# EasyEDA Pro project STM Embedded BD.eprj, schematic ATmega Embedded BD
Create Date: 2024-04-15; Page Name: 1 / 1; Project Name: STM Embedded BD; Schematic Name: ATmega Embedded BD; Update Date: 2024-04-16; Company: EasyEDA.com; Drawn: EasyEDA; Page Size: A4; Part Number: JLCPCB-002; Reviewed: EasyEDA; Version: V0.1
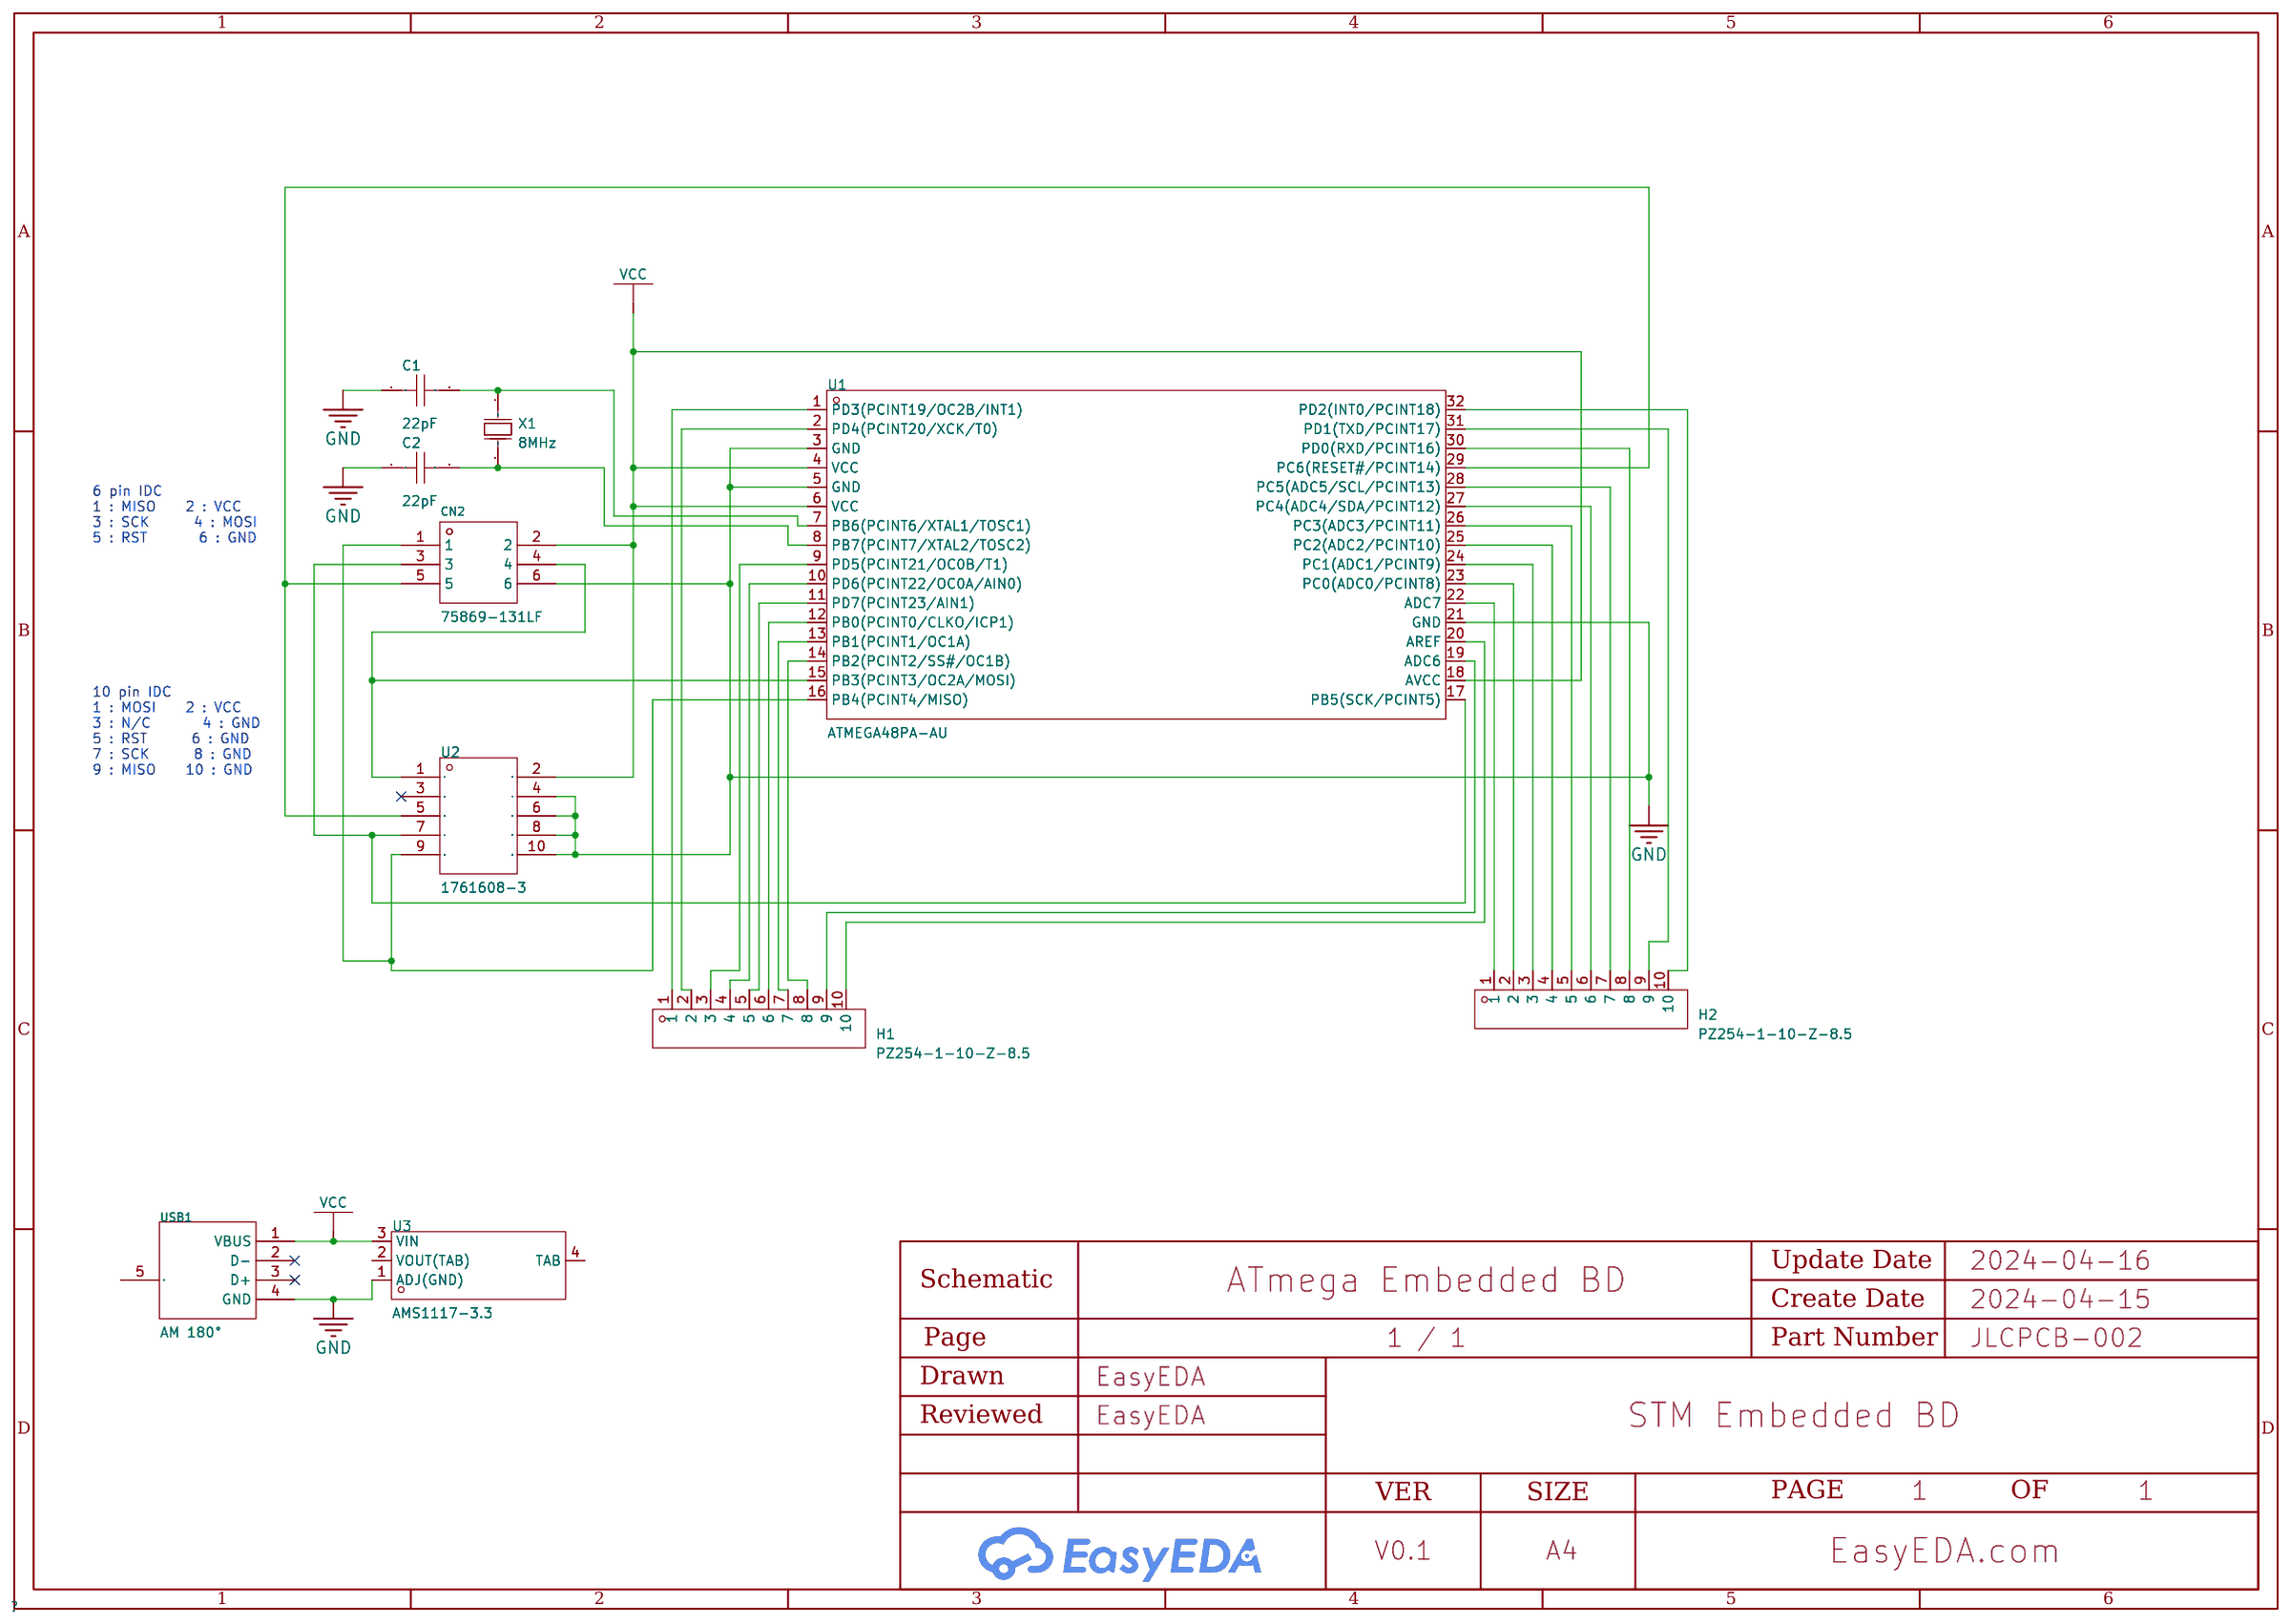
[diagram p1: schematic sheet]

## Parts
C1  22pF  [C0603]
C2  22pF  [C0603]
CN2  75869-131LF  [CONN-TH_6P-P2.54_75869-131LF]
H1  PZ254-1-10-Z-8.5  [HDR-TH_10P-P2.54-V-M]
H2  PZ254-1-10-Z-8.5  [HDR-TH_10P-P2.54-V-M]
U1  ATMEGA48PA-AU  [TQFP-32_L7.0-W7.0-P0.80-LS9.0-BL]
U2  1761608-3  [IDC-TH_10P-P2.54-S2.54_L9.2-W20.3]
U3  AMS1117-3.3  [SOT-223-4_L6.5-W3.5-P2.30-LS7.0-BR]
USB1  AM 180°  [USB-SMD_AM180]
X1  8MHz  [CRYSTAL-SMD_L11.5-W4.8-LS12.7]

## Library data of the parts
C1 C2 = 0603CG220J500NT: Capacitance: Tolerance:±5% Tolerance:±5% Voltage Rated: Temperature Coefficient:; LCSC Part Name: 22pF ±5% 50V; Supplier Part: C91701; Manufacturer: FH(风华); Supplier Footprint: 0603; JLCPCB Part Class: Extended Part; Datasheet: https://atta.szlcsc.com/upload/public/pdf/source/20200305/C486355_26A10D38EF8C2A5C37091D0039909270.pdf; Supplier: LCSC; Tolerance: ±5%
CN2 = 75869-131LF: Pins Structure:2x3P Pitch:2.54mm Mounting Style:Straight Reference Series:- Number of Pins:6P Number of Rows:2 Number of PINs Per Row:3 Row Spacing:2.54mm Contact Material:Phosphor bronze Contact Plating:Tin; LCSC Part Name: 间距:2.54mm 2x3P 直插 蓝色; Supplier Part: C168680; Manufacturer: Amphenol; Supplier Footprint: 插件,P=2.54mm; JLCPCB Part Class: Extended Part; Datasheet: https://atta.szlcsc.com/upload/public/pdf/source/20180316/C63A43DF70B4EBFBD28CCA94FAEE0128.pdf; Supplier: LCSC; Pins Structure: 2x3P; Pitch: 2.54mm; Mounting Style: Straight; Number of Pins: 6P; Number of Rows: 2; Number of PINs Per Row: 3; Row Spacing: 2.54mm; Contact Material: Phosphor bronze; Contact Plating: Tin
H1 H2 = PZ254-1-10-Z-8.5: Pin Structure:1x10P Pitch:2.54mm Row Spacing:- Circluar Pins/Square Pins:Square Pins Mounting Type:Straight Number of Rows:Plugin Number of Pins:10P Current Rating (Max):3A Voltage Rating (Max):- Length of Mating Pin:6mm Insulation Height:2.5mm Length of; LCSC Part Name: 1x10P 间距:2.54mm 方针 直插; Supplier Part: C2894933; Manufacturer: HCTL(华灿天禄); Supplier Footprint: 插件,P=2.54mm; JLCPCB Part Class: Extended Part; Datasheet: https://atta.szlcsc.com/upload/public/pdf/source/20240305/0F0A2A5C422E5D195558C9C26715A031.pdf; Supplier: LCSC; Pin Structure: 1x10P; Pitch: 2.54mm; Circluar Pins/Square Pins: Square Pins; Mounting Type: Straight; Number of Rows: Plugin; Number of Pins: 10P; Current Rating (Max): 3A; Length of Mating Pin: 6mm; Insulation Height: 2.5mm; Length of End Connection Pin: 3mm; Operating Temperature Range: -40℃~+105℃; Soldering Temperature(Max): 260℃@10S; Color: Black
U1 = ATMEGA48PA-AU: CPU Core:AVR Program Storage Size:4KB GPIO Ports Number:23 Operating Voltage Range:1.8V~5.5V Operating Voltage Range:1.8V~5.5V CPU Maximum Speed:20MHz Operating Temperature Range:-40℃~+85℃ Operating Temperature Range:-40℃~+85℃ ADC (Bit):10bit Watchdog:有 L; LCSC Part Name: 基于AVR增强型RISC架构的低功耗CMOS 8位微控制器; Supplier Part: C9433; Manufacturer: MICROCHIP(美国微芯); Supplier Footprint: TQFP-32(7x7); JLCPCB Part Class: Extended Part; Datasheet: https://atta.szlcsc.com/upload/public/pdf/source/20140724/1457707175179.pdf; Supplier: LCSC; CPU Core: AVR; Program Storage Size: 4KB; GPIO Ports Number: 23; Operating Voltage Range: 1.8V~5.5V; CPU Maximum Speed: 20MHz; Operating Temperature Range: -40℃~+85℃; ADC (Bit): 10bit; Watchdog: 有; Low-Voltage Detect: 有; Internal Oscillator: 有
U2 = 1761608-3: Pins Structure:2x5P Pitch:2.54mm Mounting Style:Straight Reference Series:- Number of Pins:10P Number of Rows:2 Number of PINs Per Row:5 Row Spacing:2.54mm Current Rating (Max):1A Contact Material:Phosphor bronze Contact Plating:Tin Operating Temperature; Supplier Part: C305912; Manufacturer: TE Connectivity(泰科电子); Supplier Footprint: 插件,P=2.5mm; JLCPCB Part Class: Extended Part; Datasheet: https://atta.szlcsc.com/upload/public/pdf/source/20181023/C305913_13B9A14E6BC94F99D9146D7418167983.pdf; Supplier: LCSC; Pins Structure: 2x5P; Pitch: 2.54mm; Mounting Style: Straight; Number of Pins: 10P; Number of Rows: 2; Number of PINs Per Row: 5; Row Spacing: 2.54mm; Current Rating (Max): 1A; Contact Material: Phosphor bronze; Contact Plating: Tin; Operating Temperature Range: -65℃~+105℃
U3 = AMS1117-3.3_C347222: Output Type: Maximum Input Voltage:12V Output Voltage:3.3V Output Voltage:3.3V MAX Output Current:1A Power Supply Rejection Ratio (PSRR):60dB@(120Hz) Dropout Voltage:1.3V@(1A) standby current:- Noise:- Feature:- Operating Temperature:- Operating Temperatu; LCSC Part Name: 输出:3.3V 电流:1A 耐压:12V; Supplier Part: C347222; Manufacturer: UMW(友台半导体); Supplier Footprint: SOT-223; JLCPCB Part Class: Extended Part; Datasheet: https://atta.szlcsc.com/upload/public/pdf/source/20231109/155D79A26D9DB04352555A58D5969DC8.pdf; Supplier: LCSC; Maximum Input Voltage: 12V; Output Voltage: 3.3V; MAX Output Current: 1A; Power Supply Rejection Ratio (PSRR): 60dB@(120Hz); Dropout Voltage: 1.3V@(1A); Output Polarity: Positive electrode; Number of Outputs: 1
USB1 = AM 180°: Connector Type:Type-A Standard:USB 2.0 Gender:公 Number of Ports:1 Number of Contacts:4P Mounting Style:卧贴 Current Rating - Power (Max):1A Operating Temperature Range:-40℃~+60℃ Operating Temperature Range:-40℃~+60℃; LCSC Part Name: Type-A 公 卧贴; Supplier Part: C2681564; Manufacturer: SHOU HAN(首韩); Supplier Footprint: SMD; JLCPCB Part Class: Extended Part; Datasheet: https://atta.szlcsc.com/upload/public/pdf/source/20210107/C2681564_25DA62A2D5638CEDBC3A14F60B11E72F.pdf; Supplier: LCSC; Connector Type: Type-A; Standard: USB 2.0; Gender: 公; Number of Ports: 1; Number of Contacts: 4P; Mounting Style: 卧贴; Current Rating - Power (Max): 1A; Operating Temperature Range: -40℃~+60℃
X1 = X49SM8MSD2SC: Crystal Type:贴片晶振 Frequency: Normal temperature Frequency Tolerance:±20ppm Normal temperature Frequency Tolerance:±20ppm External load capacitor: Frequency Stability(Full temperature range):±30ppm Frequency Stability(Full temperature range):±30ppm Operati; LCSC Part Name: 8MHz ±20ppm 20pF; Supplier Part: C12674; Manufacturer: YXC(扬兴晶振); Supplier Footprint: HC-49S-SMD; JLCPCB Part Class: Basic Part; Datasheet: https://atta.szlcsc.com/upload/public/pdf/source/20240329/3EBF42EBCAB50CA65B6FA9D7CFA1955A.pdf; Supplier: LCSC; Crystal Type: 贴片晶振; Normal temperature Frequency Tolerance: ±20ppm; Frequency Stability(Full temperature range): ±30ppm

## Nets
GND: C1.1 C2.1 CN2.6 U1.3(GND) U1.5(GND) U1.21(GND) U2.4 U2.6 U2.8 U2.10 U3.1(ADJ(GND)) USB1.4(GND)
VCC: CN2.2 U1.4(VCC) U1.6(VCC) U1.18(AVCC) U2.2 U3.3(VIN) USB1.1(VBUS)
$2N830: CN2.4 U1.15(PB3(PCINT3/OC2A/MOSI)) U2.1
$2N839: CN2.1 U1.16(PB4(PCINT4/MISO)) U2.9
$2N858: CN2.3 U1.17(PB5(SCK/PCINT5)) U2.7
$2N878: CN2.5 U1.29(PC6(RESET#/PCINT14)) U2.5
$2N1111: C1.2 U1.7(PB6(PCINT6/XTAL1/TOSC1)) X1.1(OSC1)
$2N1119: C2.2 U1.8(PB7(PCINT7/XTAL2/TOSC2)) X1.2(OSC2)
Net-(H1-1): H1.1 U1.1(PD3(PCINT19/OC2B/INT1))
Net-(H1-2): H1.2 U1.2(PD4(PCINT20/XCK/T0))
Net-(H1-3): H1.3 U1.9(PD5(PCINT21/OC0B/T1))
Net-(H1-4): H1.4 U1.10(PD6(PCINT22/OC0A/AIN0))
Net-(H1-5): H1.5 U1.11(PD7(PCINT23/AIN1))
Net-(H1-6): H1.6 U1.12(PB0(PCINT0/CLKO/ICP1))
Net-(H1-7): H1.7 U1.13(PB1(PCINT1/OC1A))
Net-(H1-8): H1.8 U1.14(PB2(PCINT2/SS#/OC1B))
Net-(H1-9): H1.9 U1.19(ADC6)
Net-(H1-10): H1.10 U1.20(AREF)
Net-(H2-1): H2.1 U1.22(ADC7)
Net-(H2-2): H2.2 U1.23(PC0(ADC0/PCINT8))
Net-(H2-3): H2.3 U1.24(PC1(ADC1/PCINT9))
Net-(H2-4): H2.4 U1.25(PC2(ADC2/PCINT10))
Net-(H2-5): H2.5 U1.26(PC3(ADC3/PCINT11))
Net-(H2-6): H2.6 U1.27(PC4(ADC4/SDA/PCINT12))
Net-(H2-7): H2.7 U1.28(PC5(ADC5/SCL/PCINT13))
Net-(H2-8): H2.8 U1.30(PD0(RXD/PCINT16))
Net-(H2-9): H2.9 U1.31(PD1(TXD/PCINT17))
Net-(H2-10): H2.10 U1.32(PD2(INT0/PCINT18))

Not connected (* = marked no-connect by the designer): U2 3*; U3 2(VOUT(TAB)) 4(TAB); USB1 2(D-)* 3(D+)* 5(EH)

## Notes on the sheet
- 6 pin IDC
  1 : MISO    2 : VCC
  3 : SCK      4 : MOSI
  5 : RST       6 : GND
- 10 pin IDC
  1 : MOSI    2 : VCC
  3 : N/C       4 : GND
  5 : RST      6 : GND
  7 : SCK      8 : GND
  9 : MISO    10 : GND
